# EAGLE design LT-33222-L v1.0 (EAGLE 7.5.0)
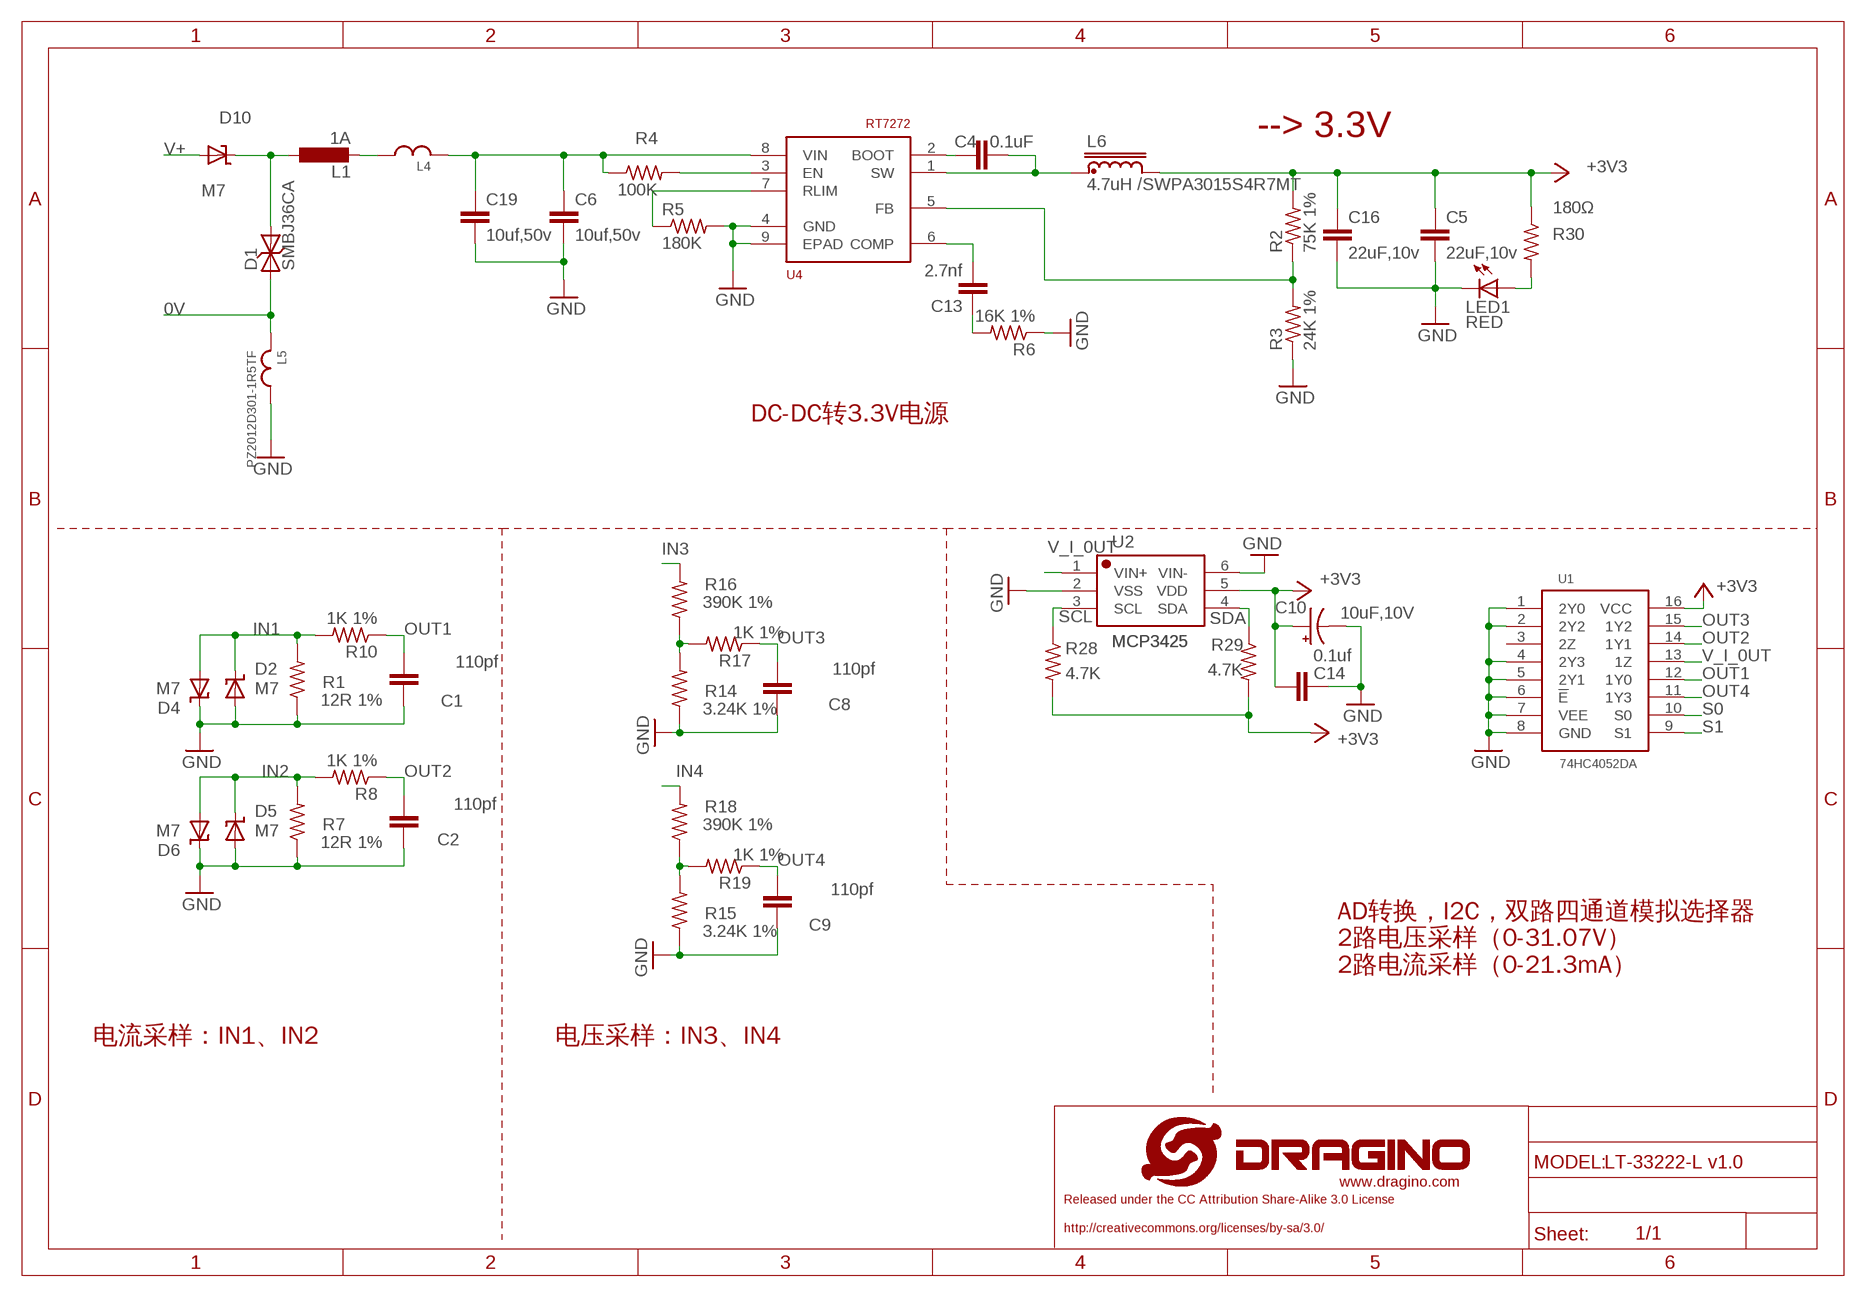
[diagram p0: schematic, sheet 1, part 1 of 2]
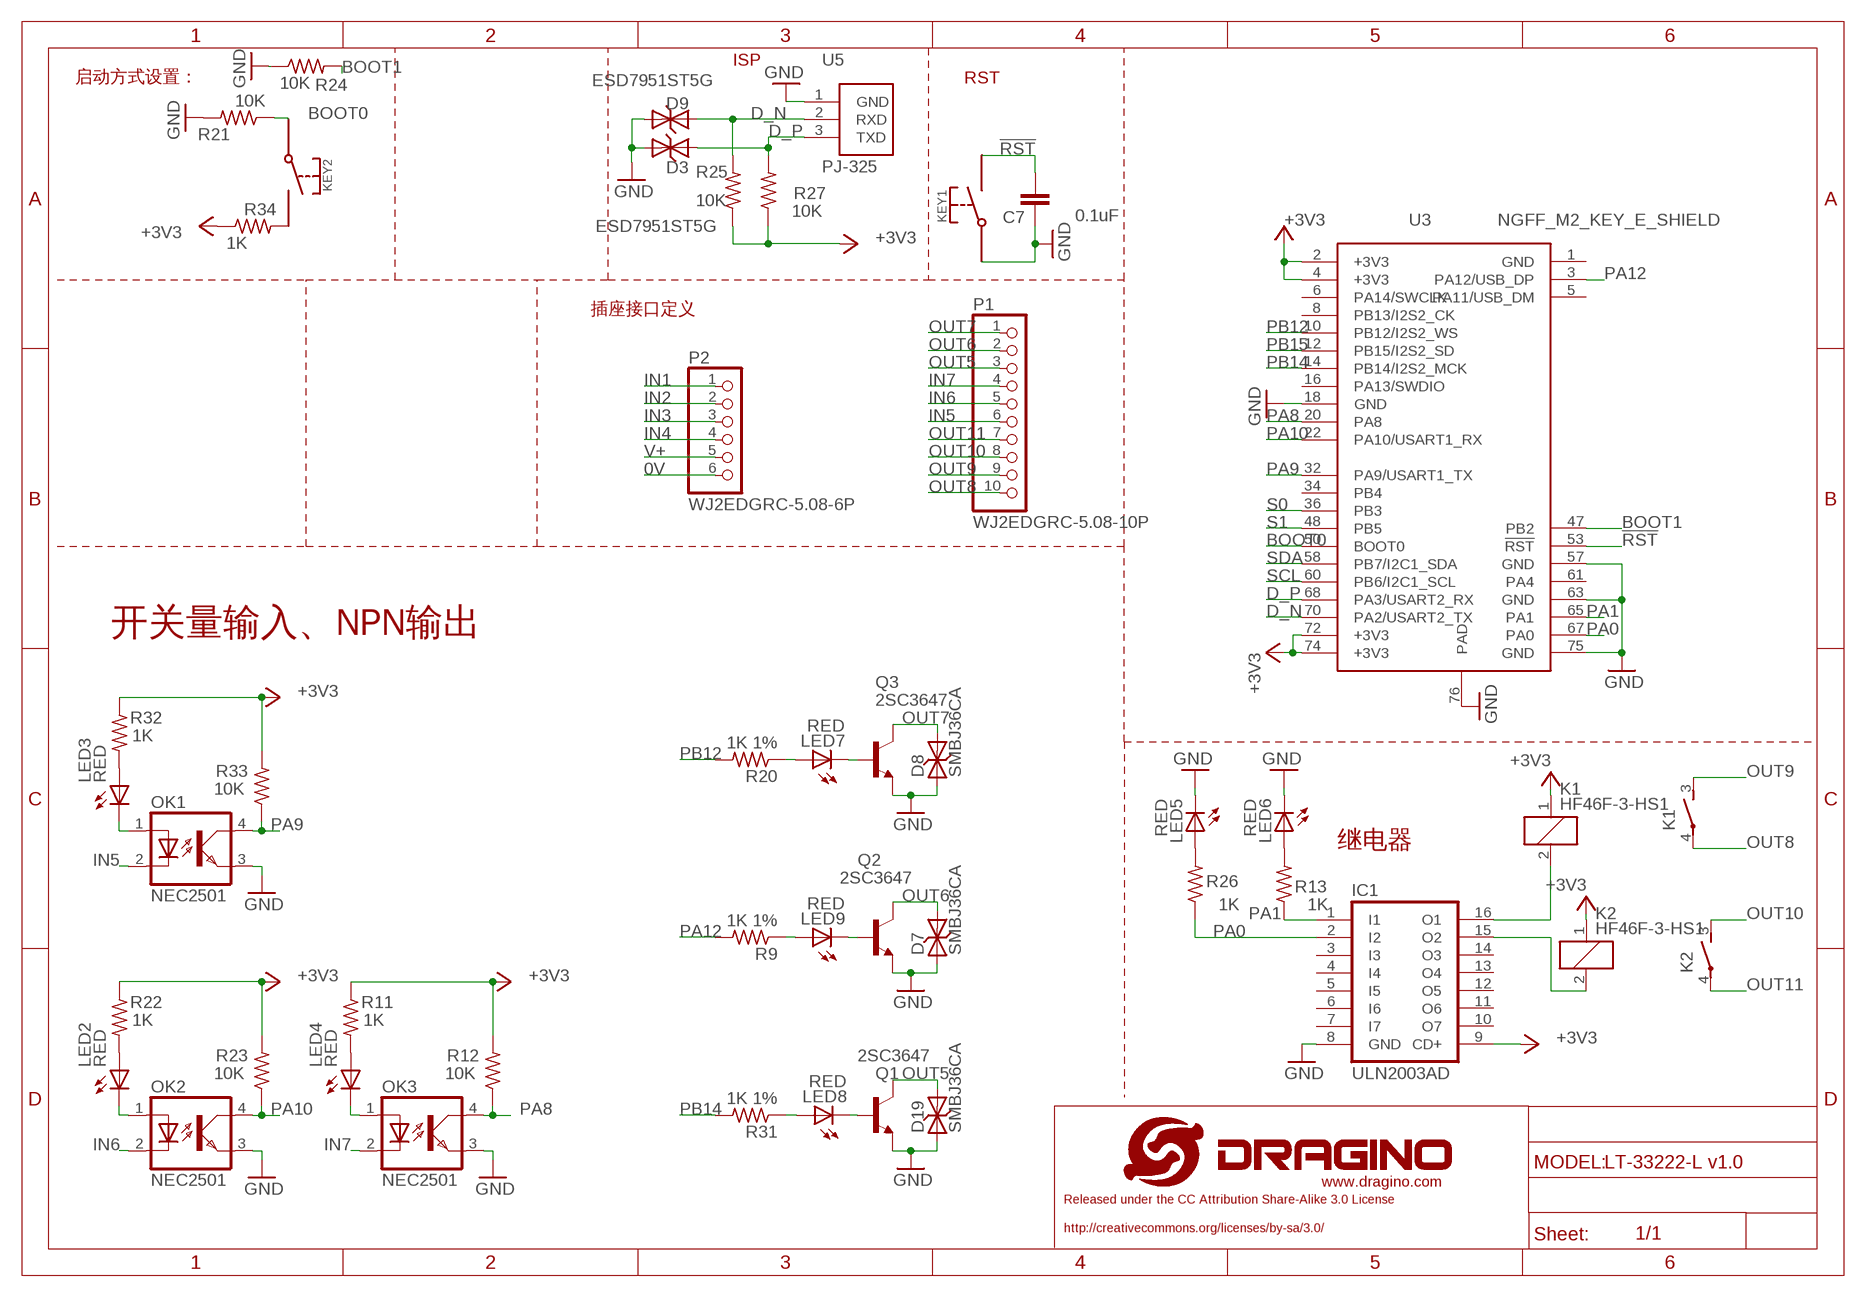
[diagram p1: schematic, sheet 1, part 2 of 2]

## Parts
C1  110pf  C-EUC0402  [C0402]
C2  110pf  C-EUC0402  [C0402]
C4  0.1uF  C-EUC0402  [C0402]
C5  22uF,10v  C-EUC1210  [C1210]
C6  10uf,50v  C-EUC1206  [C1206]
C7  0.1uF  C-EUC0402  [C0402]
C8  110pf  C-EUC0402  [C0402]
C9  110pf  C-EUC0402  [C0402]
C10  10uF,10V  CPOL-USSMCA  [SMC_A]
C13  2.7nf  C-EUC0402  [C0402]
C14  0.1uf  C-EUC0402  [C0402]
C16  22uF,10v  C-EUC1210  [C1210]
C19  10uf,50v  C-EUC1206  [C1206]
D1  SMBJ36CA  TVSDIO-214AA  [DO-214AA]
D2  M7  SCHOTTKYSMBG  [DO214AC]
D3  ESD7951ST5G  TVSSOD−923  [SOD−923]
D4  M7  SCHOTTKYSMBG  [DO214AC]
D5  M7  SCHOTTKYSMBG  [DO214AC]
D6  M7  SCHOTTKYSMBG  [DO214AC]
D7  SMBJ36CA  TVSDIO-214AA  [DO-214AA]
D8  SMBJ36CA  TVSDIO-214AA  [DO-214AA]
D9  ESD7951ST5G  TVSSOD−923  [SOD−923]
D10  M7  SCHOTTKYSMBG  [DO214AC]
D19  SMBJ36CA  TVSDIO-214AA  [DO-214AA]
IC1  ULN2003AD  [SO16]
K1  HF46F-3-HS1  [HF46F-3-HS1]
K2  HF46F-3-HS1  [HF46F-3-HS1]
KEY1  SWITCHDIL4  [SWITCH_6X6X19_DIL4]
KEY2  SWITCHDIL4  [SWITCH_6X6X19_DIL4]
L1  1A  L-EUL1812  [L1812]
L4  PZ2012D301-1R5TF  BEADS  [C2012]
L5  PZ2012D301-1R5TF  BEADS0805  [C0805]
L6  4.7uH /SWPA3015S4R7MT  INDUCTORSWPA3010S  [SWPA3010S]
LED1  RED  LED3MM  [LED3MM]
LED2  RED  LED3MM  [LED3MM]
LED3  RED  LED3MM  [LED3MM]
LED4  RED  LED3MM  [LED3MM]
LED5  RED  LED3MM  [LED3MM]
LED6  RED  LED3MM  [LED3MM]
LED7  RED  LED3MM  [LED3MM]
LED8  RED  LED3MM  [LED3MM]
LED9  RED  LED3MM  [LED3MM]
OK1  NEC2501  [DIP4]
OK2  NEC2501  [DIP4]
OK3  NEC2501  [DIP4]
P1  WJ2EDGRC-5.08-10P  [WJ2EDGRC-5.08-10P]
P2  WJ2EDGRC-5.08-6P  [WJ2EDGRC-5.08-6P]
Q1  2SC3647  [SOT-89]
Q2  2SC3647  [SOT-89]
Q3  2SC3647  [SOT-89]
R1  12R 1%  R-US_R1206  [R1206]
R2  75K 1%  R-US_R0402  [R0402]
R3  24K 1%  R-US_R0402  [R0402]
R4  100K  R-US_R0402  [R0402]
R5  180K  R-US_R0402  [R0402]
R6  16K 1%  R-US_R0402  [R0402]
R7  12R 1%  R-US_R1206  [R1206]
R8  1K 1%  R-US_R0402  [R0402]
R9  1K 1%  R-US_R0402  [R0402]
R10  1K 1%  R-US_R0402  [R0402]
R11  1K  R-US_R0402  [R0402]
R12  10K  R-US_R0402  [R0402]
R13  1K  R-US_R0402  [R0402]
R14  3.24K 1%  R-US_R1206  [R1206]
R15  3.24K 1%  R-US_R1206  [R1206]
R16  390K 1%  R-US_R1206  [R1206]
R17  1K 1%  R-US_R0402  [R0402]
R18  390K 1%  R-US_R1206  [R1206]
R19  1K 1%  R-US_R0402  [R0402]
R20  1K 1%  R-US_R0402  [R0402]
R21  10K  R-US_R0402  [R0402]
R22  1K  R-US_R0402  [R0402]
R23  10K  R-US_R0402  [R0402]
R24  10K  R-US_R0402  [R0402]
R25  10K  R-US_R0402  [R0402]
R26  1K  R-US_R0402  [R0402]
R27  10K  R-US_R0402  [R0402]
R28  4.7K  R-US_R0402  [R0402]
R29  4.7K  R-US_R0402  [R0402]
R30  180Ω  R-US_R0402  [R0402]
R31  1K 1%  R-US_R0402  [R0402]
R32  1K  R-US_R0402  [R0402]
R33  10K  R-US_R0402  [R0402]
R34  1K  R-US_R0402  [R0402]
U1  74HC4052DA  [SO16]
U2  MCP3425  [6/SOT-23]
U3  NGFF_M2_KEY_E_SHIELD  [NGFF_M2_KEY_E_SHIELD]
U4  RT7272  [RT8250-SOP8]
U5  PJ-325  [PJ-325]

## Nets
0V: D1.A L5.1 P2.6
!RST: C7.2 KEY1.2 U3.53(!RST)
+3V3: C5.1 C10.+ C14.2 C16.1 IC1.9(CD+) K1.1 K2.1 L6.P$2 R2.2 R11.1 R12.2 R22.1 R23.2 R25.1 R27.1 R28.2 R29.2 R30.1 R32.1 R33.2 R34.1 U1.16(VCC) U2.5(VDD) U3.2(+3V3) U3.4(+3V3) U3.72(+3V3) U3.74(+3V3)
BOOT0: KEY2.1 R21.1 U3.50(BOOT0)
BOOT1: R24.2 U3.47(PB2)
D_N: D9.P$1 R25.2 U3.70(PA2/USART2_TX) U5.2(RXD)
D_P: D3.P$1 R27.2 U3.68(PA3/USART2_RX) U5.3(TXD)
GND: C1.1 C2.1 C5.2 C6.2 C7.1 C8.1 C9.1 C10.- C14.1 C16.2 C19.2 D2.A D3.P$2 D4.C D5.A D6.C D7.A D8.A D9.P$2 D19.A IC1.8(GND) KEY1.1 L5.2 LED1.K(C) LED5.K(C) LED6.K(C) OK1.3(EMIT) OK2.3(EMIT) OK3.3(EMIT) Q1.E Q2.E Q3.E R1.1 R3.1 R5.2 R6.1 R7.1 R14.1 R15.1 R21.2 R24.1 U1.1(2Y0) U1.2(2Y2) U1.4(2Y3) U1.5(2Y1) U1.6(!E) U1.7(VEE) U1.8(GND) U2.2(VSS) U2.6(VIN-) U3.18(GND) U3.57(GND) U3.63(GND) U3.75(GND) U3.76(PAD) U4.4(GND) U4.9(EPAD) U5.1(GND)
IN1: D2.C D4.A P2.1 R1.2 R10.2
IN2: D5.C D6.A P2.2 R7.2 R8.2
IN3: P2.3 R16.2
IN4: P2.4 R18.2
IN5: OK1.2(C) P1.6
IN6: OK2.2(C) P1.5
IN7: OK3.2(C) P1.4
N$1: R14.2 R16.1 R17.2
N$2: D1.C D10.C L1.1
N$3: L1.2 L4.2
N$4: LED1.A R30.2
N$5: LED8.A R31.1
N$6: LED2.A R22.2
N$7: IC1.16(O1) K1.2
N$8: LED3.A R32.2
N$9: R5.1 U4.7(RLIM)
N$10: C4.1 U4.2(BOOT)
N$11: LED3.K(C) OK1.1(A)
N$12: C13.1 R6.2
N$13: LED2.K(C) OK2.1(A)
N$14: LED9.A R9.1
N$15: LED9.K(C) Q2.B
N$16: LED7.A R20.1
N$17: LED7.K(C) Q3.B
N$18: R15.2 R18.1 R19.2
N$19: LED4.A R11.2
N$20: LED8.K(C) Q1.B
N$22: KEY2.2 R34.2
N$23: LED4.K(C) OK3.1(A)
N$24: C4.2 L6.P$1 U4.1(SW)
N$25: R4.2 U4.3(EN)
N$30: LED6.A R13.2
N$31: C13.2 U4.6(COMP)
N$33: C6.1 C19.1 L4.1 R4.1 U4.8(VIN)
N$34: LED5.A R26.2
N$37: IC1.15(O2) K2.2
N$49: R2.1 R3.2 U4.5(FB)
OUT1: C1.2 R10.1 U1.12(1Y0)
OUT2: C2.2 R8.1 U1.14(1Y1)
OUT3: C8.2 R17.1 U1.15(1Y2)
OUT4: C9.2 R19.1 U1.11(1Y3)
OUT5: D19.C P1.3 Q1.C Q1.C@1(C)
OUT6: D7.C P1.2 Q2.C Q2.C@1(C)
OUT7: D8.C P1.1 Q3.C Q3.C@1(C)
OUT8: K1.4(P) P1.10
OUT9: K1.3(S) P1.9
OUT10: K2.3(S) P1.8
OUT11: K2.4(P) P1.7
PA0: IC1.2(I2) R26.1 U3.67(PA0)
PA1: IC1.1(I1) R13.1 U3.65(PA1)
PA8: OK3.4(COL) R12.1 U3.20(PA8)
PA9: OK1.4(COL) R33.1 U3.32(PA9/USART1_TX)
PA10: OK2.4(COL) R23.1 U3.22(PA10/USART1_RX)
PA12: R9.2 U3.3(PA12/USB_DP)
PB12: R20.2 U3.10(PB12/I2S2_WS)
PB14: R31.2 U3.14(PB14/I2S2_MCK)
PB15: U3.12(PB15/I2S2_SD)
S0: U1.10(S0) U3.36(PB3)
S1: U1.9(S1) U3.48(PB5)
SCL: R28.1 U2.3(SCL) U3.60(PB6/I2C1_SCL)
SDA: R29.1 U2.4(SDA) U3.58(PB7/I2C1_SDA)
V+: D10.A P2.5
V_I_0UT: U1.13(1Z) U2.1(VIN+)
Unconnected: IC1.3(I3) IC1.4(I4) IC1.5(I5) IC1.6(I6) IC1.7(I7) IC1.10(O7) IC1.11(O6) IC1.12(O5) IC1.13(O4) IC1.14(O3) U1.3(2Z) U3.1(GND) U3.5(PA11/USB_DM) U3.6(PA14/SWCLK) U3.8(PB13/I2S2_CK) U3.16(PA13/SWDIO) U3.34(PB4) U3.61(PA4)

## Notes on the sheet
- ISP
- RST
- 启动方式设置：
- --> 3.3V
- 插座接口定义
- DC-DC转3.3V电源
- 开关量输入、NPN输出
- 继电器
- AD转换，I2C，双路四通道模拟选择器
  2路电压采样（0-31.07V）
  2路电流采样（0-21.3mA）
- 电流采样：IN1、IN2 | 电压采样：IN3、IN4

## Library data of the parts
C1 C2 C4-C9 C13 C14 C16 C19 = dragino:C-EU: CAPACITOR, European symbol
C10 = rcl:CPOL-US: POLARIZED CAPACITOR, American symbol
D1 D7 D8 D19 = dragino:TVS: DIODE; OC_FARNELL: unknown
D2 D4-D6 D10 = dragino:SCHOTTKY: Suppressor diode; OC_FARNELL: unknown
D3 D9 = dragino:TVS: DIODE
IC1 = uln-udn:ULN2003A: DRIVER ARRAY
K1 K2 = relay:HF46F-3-HS1
KEY1 KEY2 = dragino:SWITCH
L1 = dragino:L-EU: INDUCTOR, European symbol; OC_FARNELL: unknown
L4 L5 = dragino:BEADS
L6 = dragino:INDUCTOR: CHOKE U15
LED1-LED9 = led:LED: LED OSRAM: - CHIPLED LG R971, LG N971, LY N971, LG Q971, LY Q971, LO R971, LY R971 LH N974, LH R974 LS Q976, LO Q976, LY Q976 LO Q996 - Hyper CHIPLED LW Q18S LB Q993, LB Q99A, LB R99A - SideLED LS A670, LO A670, LY A670, LG A670, LP A670 LB A673, LV A673, LT A673, LW A673 LH A674 LY A675 LS A676, LA A676, LO A676, LY A676, LW A676 LS A679, LY A679, LG A679 - Hyper Micro SIDELED® LS Y876, LA Y876, LO Y876, LY Y876 LT Y87S - SmartLED LW L88C, LW L88S LB L89C, LB L89S, LG L890 LS L89K, LO L89K, LY L89K LS L896, LA L896, LO L896, LY L896 - TOPLED LS T670, LO T670, LY T670, LG T670, LP T670 LSG T670, LSP T670, LSY T670, LOP T670, LYG T670 LG T671, LOG T671, LSG T671 LB T673, LV T673, LT T673, LW T673 LH T674 LS T676, LA T676, LO T676, LY T676, LB T676, LH T676, LSB T676, LW T676 LB T67C, LV T67C, LT T67C, LS T67K, LO T67K, LY T67K, LW E67C LS E67B, LA E67B, LO E67B, LY E67B, LB E67C, LV E67C, LT E67C LW T67C LS T679, LY T679, LG T679 LS T770, LO T770, LY T770, LG T770, LP T770 LB T773, LV T773, LT T773, LW T773 LH T774 LS E675, LA E675, LY E675, LS T675 LS T776, LA T776, LO T776, LY T776, LB T776 LHGB T686 LT T68C, LB T68C - Hyper Mini TOPLED® LB M676 - Mini TOPLED Santana® LG M470 LS M47K, LO M47K, LY M47K Source: http://www.osram.convergy.de LUXEON: - LUMILED® LXK2-PW12-R00, LXK2-PW12-S00, LXK2-PW14-U00, LXK2-PW14-V00 LXK2-PM12-R00, LXK2-PM12-S00, LXK2-PM14-U00 LXK2-PE12-Q00, LXK2-PE12-R00, LXK2-PE12-S00, LXK2-PE14-T00, LXK2-PE14-U00 LXK2-PB12-K00, LXK2-PB12-L00, LXK2-PB12-M00, LXK2-PB14-N00, LXK2-PB14-P00, LXK2-PB14-Q00 LXK2-PR12-L00, LXK2-PR12-M00, LXK2-PR14-Q00, LXK2-PR14-R00 LXK2-PD12-Q00, LXK2-PD12-R00, LXK2-PD12-S00 LXK2-PH12-R00, LXK2-PH12-S00 LXK2-PL12-P00, LXK2-PL12-Q00, LXK2-PL12-R00 Source: www.luxeon.com KINGBRIGHT: KA-3528ASYC Source: www.kingbright.com
OK1-OK3 = optocoupler:NEC2501
P1 = pinhead:WJ2EDGRC-5.08-10P
P2 = pinhead:WJ2EDGRC-5.08-6P
Q1-Q3 = dragino:2SC3647
R1-R34 = dragino:R-US_: RESISTOR, American symbol
U1 = dragino:74HC4052D
U2 = dragino:MCP3425
U3 = dragino:NGFF_M2_KEY_E_SHIELD
U4 = dragino:RT7272
U5 = dragino:PJ-325

## Net classes
0 default: width 0.203 mm, clearance 0.152 mm
1 vcc: width 0.254 mm

## Board
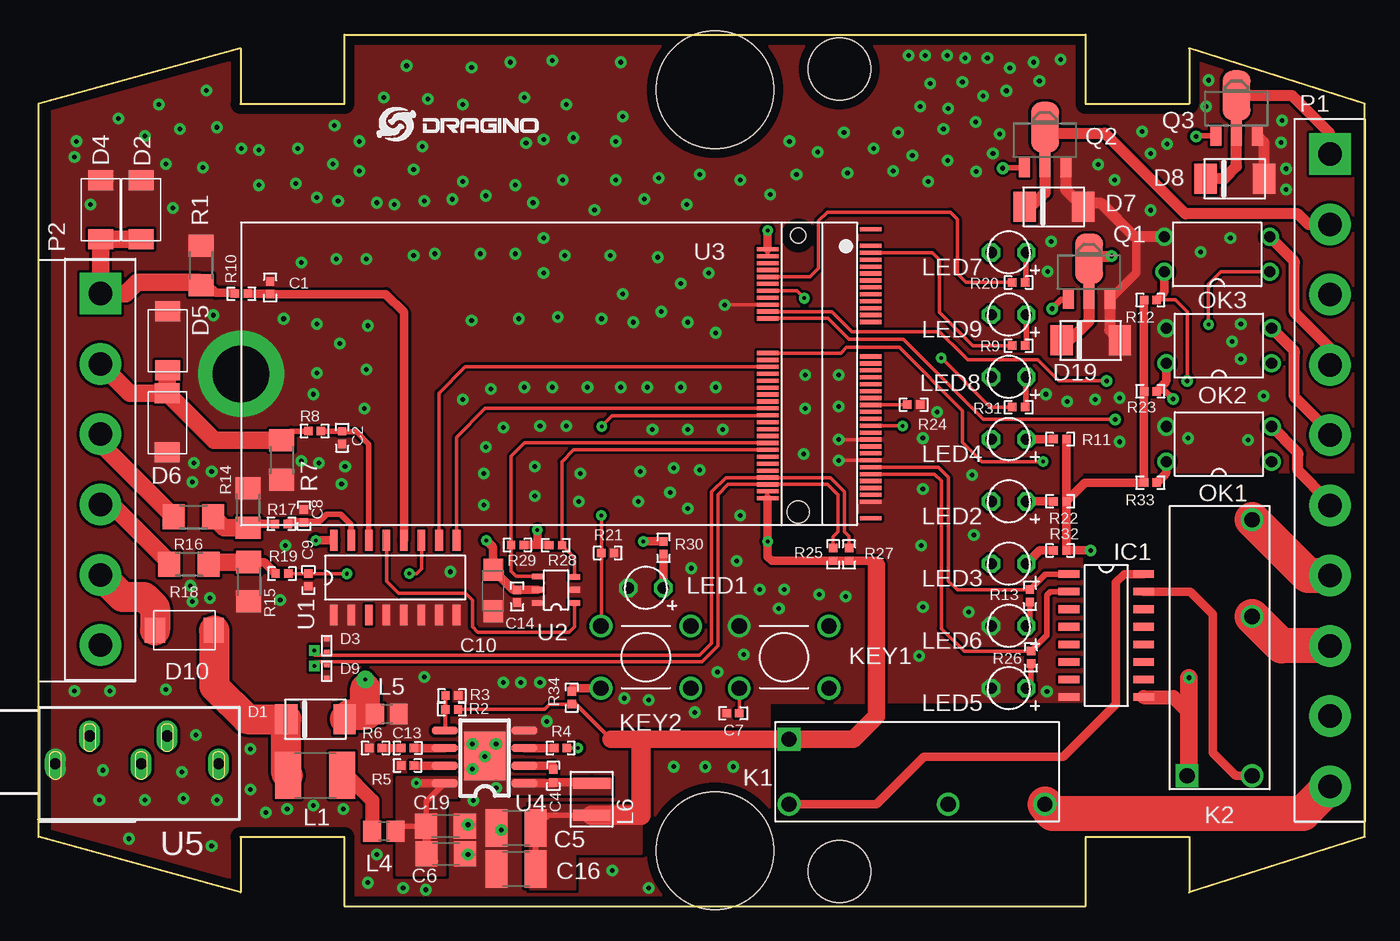
[diagram p2: board, top side]
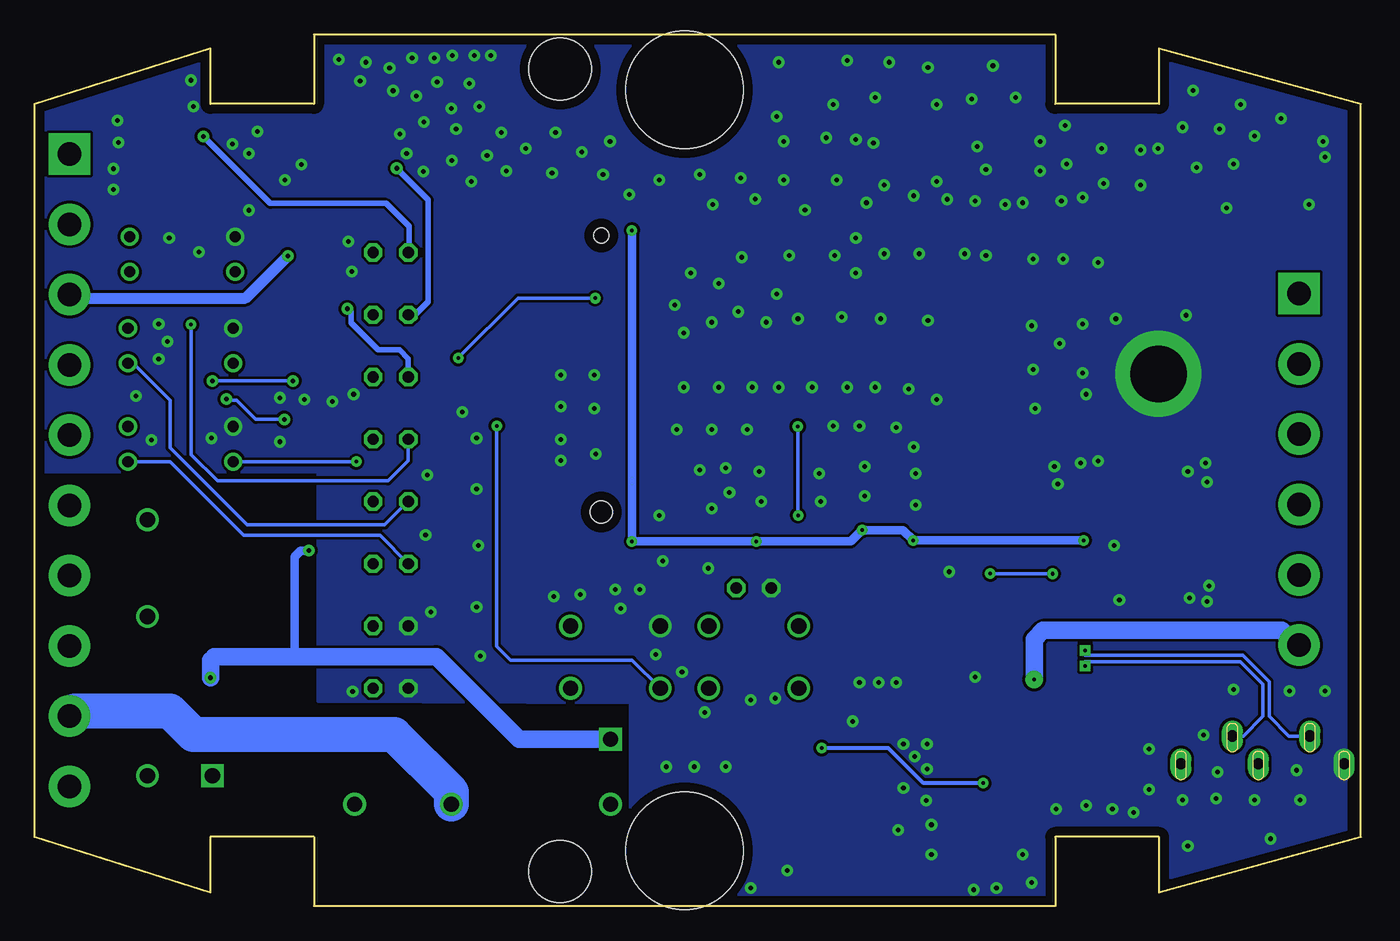
[diagram p3: board, bottom side, seen from below]

Size 95.9 x 63 mm. Coordinates in mm from the lower left corner, seen from the top.
Copper layers (1*16): Top 0.035mm / dielectric 1.5mm / Bottom 0.035mm
Design rules "default *": minimum track width 5mil, minimum drill 10mil, track to track 8mil, track to pad 10mil, pad to pad 10mil, via to via 10mil, smd to smd 8mil, copper to edge 26mil, drill to drill 10mil, minimum pad ring 10mil, minimum via ring 10mil, stop-mask expansion 1mil, vias tented up to drill 30mil, thermal gap 10mil

### Footprints (pad centres in the part's own frame; a part is rotated, then mirrored left to right if it is on the bottom)
C0402 = smd 0.61 x 0.61: 1 -0.457,0; 2 0.457,0
C1210 = smd 1.6 x 2.7: 1 -1.4,0; 2 1.4,0
C1206 = smd 1.6 x 1.8: 1 -1.4,0; 2 1.4,0
SMC_A = smd 1.6 x 1.4: + -1.5,0; - 1.5,0
DO-214AA = smd 1.62 x 2.18: A 2.11,0; C -2.11,0
DO214AC = smd 1.45 x 1.8: A 2.13,0; C -2.13,0
SOD−923 = smd 0.3 x 0.4: P$1 -0.45,0; P$2 0.45,0
SO16 = smd 0.55 x 1.5: 1 -4.445,-2.7; 2 -3.175,-2.7; 3 -1.905,-2.7; 4 -0.635,-2.7; 5 0.635,-2.7; 6 1.905,-2.7; 7 3.175,-2.7; 8 4.445,-2.7; 9 4.445,2.7; 10 3.175,2.7; 11 1.905,2.7; 12 0.635,2.7; 13 -0.635,2.7; 14 -1.905,2.7; 15 -3.175,2.7; 16 -4.445,2.7
HF46F-3-HS1 = drill 1.1 square: 1 1.05,0 | drill 1.1: 2 1.05,-4.7; 3 12.55,-4.7; 4 19.55,-4.7
SWITCH_6X6X19_DIL4 = drill 1.1: 1 -3.25,2.25; 2 -3.25,-2.25; 3 3.25,2.25; 4 3.25,-2.25
L1812 = smd 1.9 x 3.4: 1 -1.95,0; 2 1.95,0
C2012 = smd 1.3 x 1.5: 1 -0.85,0; 2 0.85,0
C0805 = smd 1.3 x 1.5: 1 -0.85,0; 2 0.85,0
SWPA3010S = smd 0.8 x 2.7: P$1 -1.15,0; P$2 1.15,0
LED3MM = drill 0.813 octagon: A -1.27,0; K 1.27,0
DIP4 = drill 0.8: 1 -1.27,-3.81; 2 1.27,-3.81; 3 1.27,3.81; 4 -1.27,3.81
WJ2EDGRC-5.08-10P = drill 1.7 pad 3 square: 1 0,0 | drill 1.7 pad 3: 2 5.08,0; 3 10.16,0; 4 15.24,0; 5 20.32,0; 6 25.4,0; 7 30.48,0; 8 35.56,0; 9 40.64,0; 10 45.72,0
WJ2EDGRC-5.08-6P = drill 1.7 pad 3 square: 1 -12.7,0 | drill 1.7 pad 3: 2 -7.62,0; 3 -2.54,0; 4 2.54,0; 5 7.62,0; 6 12.7,0
SOT-89 = smd 0.8 x 1.4: B -1.499,-1.981; E 1.499,-1.981 | smd 0.8 x 1.9: C 0,-1.727 | smd 2.032 x 3.65: C@1 0,0.94
R1206 = smd 1.6 x 1.803: 1 -1.422,0; 2 1.422,0
R0402 = smd 0.61 x 0.61: 1 -0.457,0; 2 0.457,0
6/SOT-23 = smd 0.406 x 0.813: 1 -0.965,-1.372; 2 -0.015,-1.372; 3 0.911,-1.372; 4 0.937,1.27; 5 -0.015,1.27; 6 -0.965,1.27
NGFF_M2_KEY_E_SHIELD = smd 0.3 x 1.55: 1 1.7,-0.775; 2 1.95,-8.225; 3 2.2,-0.775; 4 2.45,-8.225; 5 2.7,-0.775; 6 2.95,-8.225; 7 3.2,-0.775; 8 3.45,-8.225; 9 3.7,-0.775; 10 3.95,-8.225; 11 4.2,-0.775; 12 4.45,-8.225; 13 4.7,-0.775; 14 4.95,-8.225; 15 5.2,-0.775; 16 5.45,-8.225; 17 5.7,-0.775; 18 5.95,-8.225; 19 6.2,-0.775; 20 6.45,-8.225; 21 6.7,-0.775; 22 6.95,-8.225; 23 7.2,-0.775; 32 9.45,-8.225; 33 9.7,-0.775; 34 9.95,-8.225; 35 10.2,-0.775; 36 10.45,-8.225; 37 10.7,-0.775; 38 10.95,-8.225; 39 11.2,-0.775; 40 11.45,-8.225; 41 11.7,-0.775; 42 11.95,-8.225; 43 12.2,-0.775; 44 12.45,-8.225; 45 12.7,-0.775; 46 12.95,-8.225; 47 13.2,-0.775; 48 13.45,-8.225; 49 13.7,-0.775; 50 13.95,-8.225; 51 14.2,-0.775; 52 14.45,-8.225; 53 14.7,-0.775; 54 14.95,-8.225; 55 15.2,-0.775; 56 15.45,-8.225; 57 15.7,-0.775; 58 15.95,-8.225; 59 16.2,-0.775; 60 16.45,-8.225; 61 16.7,-0.775; 62 16.95,-8.225; 63 17.2,-0.775; 64 17.45,-8.225; 65 17.7,-0.775; 66 17.95,-8.225; 67 18.2,-0.775; 68 18.45,-8.225; 69 18.7,-0.775; 70 18.95,-8.225; 71 19.2,-0.775; 72 19.45,-8.225; 73 19.7,-0.775; 74 19.95,-8.225; 75 20.2,-0.775; X 0.5,-0.775; Y 21.4,-0.775 | drill 4.09 pad 6.2: 76 10.95,-46.3 | hole 1.6: 20.95,-6 | hole 1.1: 0.95,-6
RT8250-SOP8 = smd 1.88 x 0.61: 1 -1.219,0; 2 -1.219,-1.27; 3 -1.219,-2.54; 4 -1.219,-3.81; 5 4.547,-3.81; 6 4.547,-2.54; 7 4.547,-1.27; 8 4.547,0 | smd 2.997 x 3.505: 9 1.651,-1.956
PJ-325 = drill 0.8 pad 1.5 long: 1 1.2,-0.9; 2 9.28,1.12; 3 3.68,1.12; 4 7.4,-0.9; 5 13,-0.9
LT-PCB-FRAME = hole 8.5: 47,59; 47,4 | hole 4.5: 56,60.5; 56,2.5

### Placement (x,y rotation side)
C1  16.73,44.7 270 top
C2  21.94,33.87 90 top
C4  37.2,9.4 270 top
C5  34.52,5.66 180 top
C6  29.44,3.77 0 top
C7  50.21,13.94 0 top
C8  19.18,28.2 270 top
C9  19.5,23.58 90 top
C10  32.86,22.81 270 top
C13  26.67,11.43 0 top
C14  34.59,22.4 90 top
C16  34.52,2.68 180 top
C19  29.42,5.77 0 top
D1  20.01,13.51 0 top
D2  7.41,50.34 90 top
D3  20.82,18.85 90 top
D4  4.48,50.33 270 top
D5  9.33,40.87 90 top
D6  9.3,34.93 90 top
D7  73.4,50.55 0 top
D8  86.48,52.58 0 top
D9  20.82,16.97 270 top
D10  10.54,19.94 180 top
D19  76.07,40.89 0 top
IC1  77.19,19.56 270 top
K1  53.21,12.06 0 top
K2  83.04,8.38 90 top
KEY1  53.9,18 0 top
KEY2  43.9,18 0 top
L1  19.98,9.45 0 top
L4  24.97,5.42 180 top
L5  25.19,13.89 0 top
L6  39.99,7.73 270 top
LED1  43.9,23 180 top
LED2  70.15,29.25 180 top
LED3  70.15,24.75 180 top
LED4  70.15,33.75 180 top
LED5  70.15,15.75 180 top
LED6  70.15,20.25 180 top
LED7  70.15,47.25 180 top
LED8  70.15,38.25 180 top
LED9  70.15,42.75 180 top
OK1  85.34,33.4 90 top
OK2  85.34,40.51 90 top
OK3  85.21,47.12 90 top
P1  93.36,54.37 270 top
P2  4.45,31.57 270 top
Q1  75.94,45.85 0 top
Q2  72.77,55.37 0 top
Q3  86.61,57.66 0 top
R1  11.76,46.3 270 top
R2  29.87,14.23 0 top
R3  29.88,15.22 180 top
R4  37.73,11.43 180 top
R5  26.67,10.16 180 top
R6  24.36,11.43 0 top
R7  17.57,32.24 90 top
R8  19.95,34.34 180 top
R9  70.86,40.51 180 top
R10  14.65,44.27 180 top
R11  73.86,33.76 180 top
R12  80.39,43.81 180 top
R13  71.67,22.43 270 top
R14  15.16,28.78 270 top
R15  15.18,23.45 90 top
R16  11.19,28.14 180 top
R17  17.55,27.64 180 top
R18  10.86,24.71 180 top
R19  17.59,24.03 180 top
R20  70.86,45.09 180 top
R21  41.14,25.53 0 top
R22  73.86,29.26 180 top
R23  80.39,37.21 180 top
R24  63.27,36.25 180 top
R25  57.45,25.43 90 top
R26  71.75,17.98 270 top
R27  58.59,25.43 90 top
R28  37.38,26.09 180 top
R29  34.62,26.11 0 top
R30  45.18,25.91 270 top
R31  70.86,36.07 180 top
R32  73.86,25.71 180 top
R33  80.39,30.61 180 top
R34  38.55,15.06 90 top
U1  25.77,23.75 0 top
U2  37.36,22.89 90 top
U3  60.93,49.43 270 top
U4  33.9,8.89 180 top
U5  0,11.18 0 top
U$1  [LT-PCB-FRAME]  1.9,0 0 top
U$2  LOGO-NEW  [LOGO-SILK-NEW]  24.43,55.3 0 top
U$5  [LT-PCB-FRAME]  1.9,0 0 top

### Tracks (layer width: path | path; a pad name or v marks a point on that pad's centre or on a via)
0V  (via drill 0.25 pad 1.27)
  Top 1.27: 23.62,15.75 v23.62,16.38 | L5.1 24.29,13.84 23.74,13.84
  Top 2.184: D1.A 22.45,13.84 23.74,13.84 23.62,13.97 23.62,15.75
  Bottom 1.27: P2.6 4.64,18.87 5.71,19.94 22.98,19.94 23.62,19.3 v23.62,16.38
!RST  (via drill 0.25)
  Top 0.254: KEY1.2 50.67,15.73 C7.2 | U3.53 60.16,34.72 v62.48,34.72
  Bottom 0.254: KEY1.2 52.68,17.78 61.46,17.78 62.48,18.8 v62.48,34.72
+3V3  (via drill 0.25, 0.33 pad 0.33)
  Top 0.254: R2.2 36.57,14.23 36.95,14.61 R34.1
  Top 0.305: U3.74 U3.72 | U3.2 U3.4 | R34.1 38.84,14.61 41.38,12.06
  Top 0.406: L6.P$2 36.84,6.58 C5.1 C16.1
  Top 0.61: R12.2 R23.2 R33.2 75.66,30.61 R22.1 | R28.2 36.9,26.11 36.06,26.11 | 83.18,9.57 K2.1 | R22.1 | R11.1 R22.1 | R22.1 R32.1 v76.07,25.71 v76.07,25.7 | 60.57,24.64 60.24,24.97 R27.1 R25.1 53,24.97 52.7,25.27 v52.7,26.36 U3.74 | v43.71,26.36 R30.1 | v52.7,48.84 U3.2 | v20.04,26.44 U1.16 | v32.35,26.44 32.86,25.93 C10.+ 34.31,22.86 C14.2 U2.5 | R29.2 36.06,26.11 | 36.06,26.11 v36.06,27.18
  Top 1.016: IC1.9 82.06,15.11 83.18,13.99
  Top 1.27: 83.18,9.57 83.18,13.99 v83.18,16.51 | 60.57,24.64 60.57,13.72 58.92,12.06 K1.1 43.56,12.06 41.38,12.06
  Top 1.422: L6.P$2 43.56,6.58 43.56,12.06
  Bottom 0.61: 83.18,17.78 82.93,18.03 | v76.07,25.7 76.65,25.7 77.08,25.27 77.08,18.54 77.59,18.03 | v52.7,48.84 v52.7,26.36 v43.71,26.36 36.88,26.36 v36.06,27.18 33.09,27.18 v32.35,26.44 v20.04,26.44
  Bottom 1.27: 83.18,17.78 v83.18,16.51 | 82.93,18.03 77.59,18.03 66.83,18.03 60.87,12.06 K1.1
  pour Top (isolate 0.406, no thermals): 35.55,7.24 43.56,7.24 43.56,3.81 38.73,3.81 38.73,1.27 35.55,1.27
BOOT0  (via drill 0.25)
  Top 0.254: KEY2.1 40.69,20.29 R21.1 v40.69,28.25 | U3.50 52.66,35.43 41.47,35.43 v40.71,34.67
  Bottom 0.254: v40.69,28.25 40.69,34.65 v40.71,34.67
BOOT1
  Top 0.254: U3.47 60.17,36.25 R24.2
D_N  (via drill 0.25)  (1 unrouted)
  Top 0.254: U3.70 49.85,30.48 49.12,29.75 49.12,18.83 47.97,17.68 20.7,17.68 | R25.2 57.45,26.7 57.8,27.05 57.8,29.75 57.05,30.5 52.7,30.5 | 20.7,17.68 19.93,17.68 v19.93,17.35 | D9.P$1 20.7,17.42 20.7,17.68
  Bottom 0.254: U5.2 8.5,12.3 7.08,13.72 7.08,16.03 8.73,17.68 19.93,17.68 v19.93,17.35
D_P  (via drill 0.25)  (1 unrouted)
  Top 0.254: U3.68 49.7,30.98 48.66,29.94 48.66,19.02 47.78,18.14 20.7,18.14 | R27.2 58.59,26.72 58.26,27.05 58.26,29.94 57.24,30.96 52.7,30.96 | 20.7,18.14 19.93,18.14 v19.93,18.47 | D3.P$1 20.7,18.4 20.7,18.14
  Bottom 0.254: U5.3 5.21,12.3 6.62,13.72 6.62,16.22 8.54,18.14 19.93,18.14 v19.93,18.47
GND  (via drill 0.33 pad 0.33)
  Top 0.254: U3.18 v49.61,43.48 v49.61,43.47 | U3.57 v57.86,33.73 | U3.63 57.86,32.23 v57.86,32.21
  Top 0.61: Q1.E 79.37,45.8 79.37,48.39 | 32.38,11.43 32.38,10.97 U4.9
  Top 0.813: Q3.E 88.59,55.19 D8.A | Q2.E 74.27,51.79 D7.A 75.77,50.8 76.83,50.8 79.24,48.39 79.37,48.39 OK3.3 | Q1.E 77.44,41.63 D19.A
  other vias: 31.37,11.71 31.37,9.91 33.07,11.71 45.91,10.08 9.2,15.66 67.8,53.1 69,54.4 69.5,55.8 65.42,56.19 72.36,59.65 71.95,61 64.45,59.46 68.6,61.3 67,61.3 65.7,61.5 64.1,61.5 62.9,61.5 70.23,60.58 69.98,58.94 73.9,61.2 52.88,51.43 66.79,59.56 67.74,56.69 79.8,56 63.73,57.82 46.86,50.72 80.4,54.4 81.6,55.1 65.76,57.66 84.4,57.8 84.6,59.7 43.79,51.12 89.83,55.19 89.9,56.8 90.2,53.3 90.2,51.8 76.6,53.6 77.8,52.5 80.4,50.3 32.27,10.81 72.9,15.5 63.66,18.07 4.38,7.66 6.54,4.87 10.47,7.79 16.44,6.77 5.14,15.54 2.6,15.54 11.36,12.36 23.81,1.69 26.35,1.31 31.05,5.88 41.46,2.58 50.22,10.07 44.13,1.31 33.59,16.17 34.86,16.17 36.25,16.17 27.87,16.55 42.35,15.03 44.13,14.9 47.43,14.01 49.08,16.93 50.99,18.2 58.35,22.39 56.45,22.52 53.91,22.9 52.13,22.9 50.48,24.93 53.53,21.5 63.94,21.63 63.81,26.08 63.94,30.14 35.11,58.46 17.46,22.14 20.25,32.05 18.98,32.17 22.16,31.79 21.78,40.68 29.78,24.17 20.12,42.08 20.12,38.52 19.87,37 23.55,35.98 23.68,38.78 23.81,41.95 17.71,42.46 30.67,36.62 32.7,37.38 35.11,37.51 37.14,37.51 39.68,37.51 42.1,37.51 44,37.51 46.41,37.51 48.95,37.51 32.19,29 32.19,31.28 32.32,33.19 33.59,34.59 36.25,34.71 38.16,34.71 35.87,31.79 35.87,29.63 39.17,31.28 39.05,29.25 43.37,29.25 43.49,31.41 45.91,31.66 45.65,29.89 46.92,28.74 47.18,24.43 47.81,31.54 44.38,34.46 46.92,34.46 49.46,34.46 55.43,35.98 55.43,38.4 57.84,38.4 57.84,36.11 55.3,32.68 18.98,46.52 21.52,46.78 23.68,46.78 27.11,47.03 28.63,47.16 31.94,47.16 34.48,47.16 38.03,47.03 41.33,47.03 44.76,46.91 48.45,45.76 48.95,41.44 45.02,42.97 42.22,44.24 40.7,42.46 34.73,42.46 31.3,42.33 37.52,42.59 36.51,45.76 36.51,48.3 32.32,51.35 29.9,51.1 27.87,50.97 25.71,50.72 24.44,50.84 21.65,50.97 20.12,51.22 18.6,52.24 37.91,52.49 41.71,52.49 47.81,52.87 50.73,52.49 58.48,53 58.23,55.92 54.29,55.29 54.8,52.87 56.32,54.52 60.38,54.78 62.16,55.92 63.18,54.27 61.78,53.13 64.32,52.37 65.72,53.89 35.24,55.16 38.16,57.95 38.67,55.54 42.22,57.06 42.1,61 37.14,61.13 34.09,61 31.3,60.62 28.13,58.34 26.6,60.75 24.95,58.46 27.74,54.91 30.67,57.95 21.39,56.43 23.17,53.13 15.93,54.65 14.66,54.78 10.22,56.18 12.12,58.97 5.77,56.94 2.6,54.14 2.73,55.29 8.7,57.95 9.2,53.64 9.71,50.46 3.74,50.72 11.87,53.38 12.89,56.3 21.27,53.64 30.67,52.37 68.3,58.55 33.46,5.5 31.05,3.73 28,1.19 22.03,7.03 19.87,7.28 17.97,7.03 15.3,8.42 7.68,7.66 12.51,4.36 4.63,9.82 10.35,9.69 12.89,7.66 15.3,11.35 24.44,3.73 40.19,50.33 64.96,35.73 48.19,10.07 18.73,54.78 23.17,55.29 27.11,53.26 34.48,52.11 35.75,50.84 36.51,55.41 7.68,55.67 10.98,23.16 11.11,22.01 12.38,22.27 17.84,26.08 21.9,30.52 12.63,42.71 11.11,30.65 15.93,52.11 46.41,45 41.71,55.29 63.94,33.82 67.5,31.16 67.62,26.84 67.24,21.25 50.73,28.24 42.98,42.21 46.92,42.21 86.17,48.3 84.01,47.29 86.29,40.81 86.93,39.54 86.93,42.08 83.12,33.82 87.44,33.7 88.58,36.87 74.35,36.49 76.39,36.62 78.16,33.57 73.21,48.05 72.96,45.89 72.83,37 78.16,36.74 44.83,52.63 36.75,13.36 31.42,7.65 33.07,8.54 11.24,32.05 12.51,31.41
  pour Top (rank 2, no thermals): 1,63.9 96.9,63.9 96.9,31.4 75.4,31.4 75.4,14.8 52.8,14.7 52.8,-0.4 1,-0.4
  pour Bottom (rank 2, no thermals): 1.1,64 96.9,64 96.9,31.4 75.4,31.4 75.4,14.8 52.8,14.7 52.8,-0.4 1.1,-0.4
IN1
  Top 0.61: R10.2 14.14,44.32 12.82,44.32 12.26,44.88 R1.2
  Top 1.27: D2.C D4.A 4.48,44.27 P2.1 6.29,44.27 7.11,45.09 11.56,45.09 R1.2
IN2
  Top 0.406: R7.2 18.25,34.34 R8.2
  Top 1.27: P2.2 6.58,37.06 D6.A | D5.C 9.3,38.71 D6.A | D6.A 12.7,33.67 R7.2
IN3
  Top 1.27: R16.2 4.45,33.46 P2.3
IN4
  Top 1.27: P2.4 5.25,29.03 9.44,24.85 R18.2
IN5
  Top 0.813: P1.6 93.36,29.06 arc45 93.27,29.28 91.05,31.5 91.05,32.63 arc45 90.96,32.86 OK1.2
IN6
  Top 0.813: P1.5 93.36,34.14 arc45 93.27,34.36 90.8,36.83 90.8,40 arc45 90.71,40.23 OK2.2
IN7
  Top 0.813: P1.4 93.36,40.23 arc45 93.27,40.46 90.8,42.93 90.8,46.48 arc45 90.71,46.7 OK3.2
N$1
  Top 0.61: R14.2 15.44,27.64 R17.2
  Top 1.27: R16.1 13.39,27.36 R14.2
N$2
  Top 2.184: D10.C 12.7,19.94 12.7,15.88 15.05,13.52 D1.C 17.9,9.58 L1.1
N$3
  Top 1.016: L1.2 21.93,9.81 24.12,7.62 L4.2
N$4
  Top 0.61: LED1.A R30.2
N$5
  Top 0.406: R31.1 arc45 71.37,36.19 71.37,38.2 LED8.A
N$6
  Top 0.61: LED2.A 71.43,29.26 R22.2
N$7
  Top 0.61: IC1.16 78.5,24 77.9,23.4 77.9,14.6 74.09,10.79 64,10.79 60.57,7.37 K1.2
N$8
  Top 0.61: LED3.A 72.38,25.71 R32.2
N$9
  Top 0.61: U4.7 R5.1
N$10
  Top 0.61: U4.2 37.2,10.16 C4.1
N$11
  Bottom 0.254: LED3.K 70.93,26.8 80.77,26.8 86.1,32.13 OK1.1
N$12
  Top 0.61: R6.2 C13.1
N$13
  Bottom 0.254: LED2.K 70.57,27.56 80.51,27.56 86.1,33.15 86.1,36.58 88.77,39.24 OK2.1
N$14
  Top 0.406: R9.1 71.4,40.6 71.4,42.73 LED9.A
N$15  (via drill 0.33)
  Top 0.406: Q2.B 69.77,53.39 v69.72,53.34
  Bottom 0.406: v69.72,53.34 67.43,51.05 67.43,43.69 68.37,42.75 LED9.K
N$16
  Top 0.406: R20.1 arc45 71.37,45.21 71.37,47.2 LED7.A
N$17  (via drill 0.33)
  Top 0.406: Q3.B 83.74,55.68 v83.69,55.63
  Bottom 0.406: v83.69,55.63 78.86,50.8 70.48,50.8 68.83,49.15 68.83,47.3 LED7.K
N$18
  Top 0.61: R15.2 16.29,24.87 R19.2
  Top 1.27: R18.1 12.44,24.87 R15.2
N$19
  Top 0.61: LED4.A R11.2
N$20  (via drill 0.33)
  Top 0.406: Q1.B 73.96,43.87 v73.27,43.18
  Bottom 0.406: v73.27,43.18 73.02,42.93 73.02,42.16 71.06,40.2 69.5,40.2 68.88,39.58 LED8.K
N$22
  Top 0.61: KEY2.2 38.55,15.75 R34.2
N$23  (via drill 0.25)
  Top 0.254: OK3.1 85.47,45.85 84.58,44.96 v84.58,42.04
  Bottom 0.254: LED4.K 68.88,32.21 70.35,30.73 82.67,30.73 84.58,32.64 v84.58,42.04
N$24
  Top 0.61: U4.1 37.2,8.89 C4.2 39.99,8.95 L6.P$1
  Top 0.813: L6.P$1
  pour Top (isolate 0.406, no thermals): 34.28,9.14 41.4,9.14 41.4,8.64 41.4,8.13 34.28,8.13
N$25
  Top 0.61: R4.2 U4.3
N$30
  Top 0.406: R13.2 71.67,20.5 LED6.A
N$31
  Top 0.61: U4.6 C13.2
N$33  (via drill 0.25)
  Top 0.254: 28.57,3.26 28.55,3.26 | R4.1
  Top 0.305: v38.98,11.43 R4.1
  Top 0.406: U4.8 28.02,7.55 C19.1 26.16,5.77 L4.1
  Top 0.61: v27.3,8.89 U4.8 | C19.1 28.04,5.74 C6.1 28.06,3.77 28.57,3.26
  Bottom 0.305: v27.3,8.89 31.62,8.89 34.16,11.43 v38.98,11.43
  pour Top (isolate 0.305, no thermals): 25.9,9.27 30.22,9.27 30.22,7.87 29.33,7.87 29.33,2.29 25.9,2.29
N$34
  Top 0.406: R26.2 71.75,16.08 LED5.A
N$37
  Top 0.61: IC1.15 83.27,22.73 84.9,21.1 84.9,11.1 86.57,9.43 K2.2
N$49
  Top 0.305: U4.5 29.41,12.7 R2.1 29.42,14.24 R3.2
OUT1
  Top 0.61: U1.12 26.41,42.93 25.09,44.25 C1.2 16.71,44.27 R10.1
OUT2
  Top 0.406: R8.1 20.42,34.33 C2.2 21.98,34.29 22.98,34.29 23.87,33.4 U1.14
OUT3
  Top 0.406: C8.2 19.25,27.81 20.31,27.81 20.82,28.32 21.84,28.32 22.6,27.56 U1.15
  Top 0.61: R17.1 18.12,27.74 C8.2
OUT4  (via drill 0.25)
  Top 0.254: U1.11 27.68,24.38 27.33,24.04 v26.8,24.04 v26.79,24.03 | R19.1 C9.2 | C9.2 | C9.2 v22.28,24.03 v22.29,24.03
  Bottom 0.254: v22.29,24.03 v26.79,24.03
OUT5  (via drill 0.33)
  Top 0.406: 73.96,40.56 D19.C
  Top 0.813: D19.C 74.21,40.64 74.29,40.64 75.94,42.29 Q1.C Q1.C@1 76.14,46.99 v77.59,46.99
  Bottom 0.813: P1.3 93.09,43.94 80.64,43.94 v77.59,46.99
OUT6
  Top 0.813: P1.2 91.8,49.29 91.05,50.04 82.93,50.04 77.08,55.88 73.27,55.88 72.77,55.37 | Q2.C@1 72.77,55.37 | D7.C 71.75,50.55 72.77,51.56 Q2.C 72.77,55.37
OUT7
  Top 0.813: P1.1 93.34,54.39 93.34,55.88 90.62,58.6 Q3.C@1 Q3.C 86.61,53.47 85.72,52.58 D8.C
OUT8
  Top 2.54: P1.10 91.41,6.7 73.3,6.7 73.1,6.9 73.1,7 72.76,7.34 K1.4
OUT9
  Bottom 2.54: K1.3 65.76,8.26 69.9,12.4 84.4,12.4 86.1,14.1 92.99,14.1 P1.9
OUT10
  Top 2.54: P1.8 89.87,18.81 K2.3
OUT11
  Top 2.54: P1.7 91.79,23.89 K2.4
PA0
  Top 0.254: U3.67 64.78,31.23 65.27,30.73 65.27,20.07 66.92,18.41 71.73,18.41 R26.1
  Top 0.406: IC1.2 73.15,22.73 72.89,22.48 72.89,19.58 R26.1
PA1
  Top 0.254: U3.65 65.04,31.73 65.78,30.99 65.78,23.5 66.42,22.86 71.65,22.86 R13.1
  Top 0.406: IC1.1 72.79,24 R13.1
PA8  (via drill 0.33)
  Top 0.254: R12.1 82.19,43.81 83.05,42.95 v83.05,37.97 | U3.20 57.35,42.98 58.8,41.53 65.15,41.53 66.8,39.88 67.18,39.5 72.26,39.5 73.78,37.97 v77.21,37.97
  Top 0.61: R12.1 81.31,44.28 arc45 81.4,44.51 OK3.4
  Bottom 0.254: v83.05,37.97 v77.21,37.97
PA9  (via drill 0.25)
  Top 0.254: 80.89,30.56 R33.1 | U3.32 58.01,39.98 58.41,40.39 62.23,40.39 66.8,35.81 66.8,33.53 68.19,32.13 v72.64,32.13
  Top 0.61: R33.1 81.44,31.2 arc45 81.53,31.42 OK1.4
  Bottom 0.254: OK1.4 v72.64,32.13
PA10  (via drill 0.33)
  Top 0.254: v77.85,35.18 68.32,35.18 62.53,40.97 58.59,40.97 57.09,42.48 U3.22
  Top 0.406: R23.1 81.48,37.21 v82.04,36.65
  Top 0.61: R23.1 81.44,37.8 arc45 81.53,38.03 OK2.4
  Bottom 0.254: v77.85,35.18 79.9,35.18 81.3,36.58 81.96,36.58 v82.04,36.65
PA12
  Top 0.254: R9.2 67.56,40.51 65.15,42.93 65.15,46.74 64.64,47.24 60.17,47.24 U3.3
PB12
  Top 0.254: U3.10 55.76,45.48 56.38,46.1 56.38,49.53 57.02,50.16 65.91,50.16 66.42,49.66 66.42,45.72 67.05,45.09 R20.2
PB14  (via drill 0.25)
  Top 0.254: R31.2 68.83,36.07 v65.27,39.62 | U3.14 54.83,44.48 v55.37,43.94
  Bottom 0.254: v55.37,43.94 60.95,43.94 v65.27,39.62
S0
  Top 0.254: U1.10 28.95,37.08 30.84,38.98 U3.36
S1
  Top 0.254: U1.9 30.22,33.91 32.29,35.98 U3.48
SCL
  Top 0.254: U3.60 38.69,32.98 37.84,32.13 R28.1 38.73,25.2 U2.3
SDA
  Top 0.254: U3.58 35.12,33.48 34.16,32.51 R29.1 34.16,24.2 34.53,23.83 U2.4
  Top 0.305: 34.13,26.09 R29.1
V+
  Top 2.184: P2.5 6.05,22.35 7.62,22.35 8.41,21.56 D10.A
V_I_0UT
  Top 0.254: U2.1 38.73,20.19 38.35,19.81 31.74,19.81 31.36,20.19 31.36,22.1 30.86,22.61 26.03,22.61 25.14,23.5 U1.13

### Text on the board
tDocu: LT-33222-L v1.0